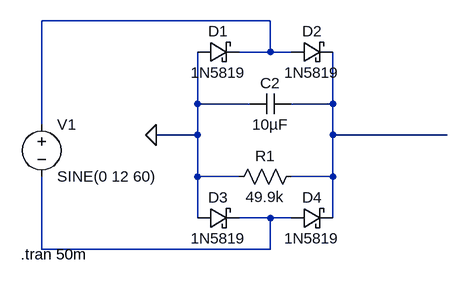
[diagram p0: schematic EE330Step6.asc]
EE330Step6.asc, the LTspice schematic file:
Version 4
SHEET 1 1220 680
WIRE 208 -80 -144 -80
WIRE 208 -32 208 -80
WIRE 208 -32 160 -32
WIRE 240 -32 208 -32
WIRE 96 48 96 -32
WIRE 176 48 96 48
WIRE 304 48 304 -32
WIRE 304 48 240 48
WIRE -144 80 -144 -80
WIRE 96 96 96 48
WIRE 96 96 32 96
WIRE 304 96 304 48
WIRE 480 96 304 96
WIRE 96 160 96 96
WIRE 160 160 96 160
WIRE 304 160 304 96
WIRE 304 160 240 160
WIRE 96 224 96 160
WIRE 208 224 160 224
WIRE 240 224 208 224
WIRE 304 224 304 160
WIRE -144 272 -144 160
WIRE 208 272 208 224
WIRE 208 272 -144 272
FLAG 32 96 0
SYMBOL voltage -144 64 R0
WINDOW 123 0 0 Left 0
WINDOW 39 0 0 Left 0
SYMATTR InstName V1
SYMATTR Value SINE(0 12 60)
SYMBOL cap 240 32 R90
WINDOW 0 0 32 VBottom 2
WINDOW 3 32 32 VTop 2
SYMATTR InstName C2
SYMATTR Value 10µF
SYMATTR SpiceLine V=16 Irms=8.71 Rser=0.00522854 Lser=0
SYMBOL res 256 144 R90
WINDOW 0 0 56 VBottom 2
WINDOW 3 32 56 VTop 2
SYMATTR InstName R1
SYMATTR Value 49.9k
SYMATTR SpiceLine tol=1 pwr=0.1
SYMBOL schottky 96 -16 R270
WINDOW 0 32 32 VTop 2
WINDOW 3 0 32 VBottom 2
SYMATTR InstName D1
SYMATTR Value 1N5819
SYMATTR Description Diode
SYMATTR Type diode
SYMBOL schottky 240 -16 R270
WINDOW 0 32 32 VTop 2
WINDOW 3 0 32 VBottom 2
SYMATTR InstName D2
SYMATTR Value 1N5819
SYMATTR Description Diode
SYMATTR Type diode
SYMBOL schottky 96 240 R270
WINDOW 0 32 32 VTop 2
WINDOW 3 0 32 VBottom 2
SYMATTR InstName D3
SYMATTR Value 1N5819
SYMATTR Description Diode
SYMATTR Type diode
SYMBOL schottky 240 240 R270
WINDOW 0 32 32 VTop 2
WINDOW 3 0 32 VBottom 2
SYMATTR InstName D4
SYMATTR Value 1N5819
SYMATTR Description Diode
SYMATTR Type diode
TEXT -176 280 Left 2 !.tran 50m

The netlist it stands for:
* EE330Step6.asc
V1 N001 N003 SINE(0 12 60)
C2 N002 0 10µF V=16 Irms=8.71 Rser=0.00522854 Lser=0
R1 N002 0 49.9k tol=1 pwr=0.1
D1 0 N001 1N5819
D2 N001 N002 1N5819
D3 0 N003 1N5819
D4 N003 N002 1N5819
.model D D
.lib standard.dio
.tran 50m
.backanno
.end